# EAGLE design BT_Audio_iJoey (EAGLE 6.1)
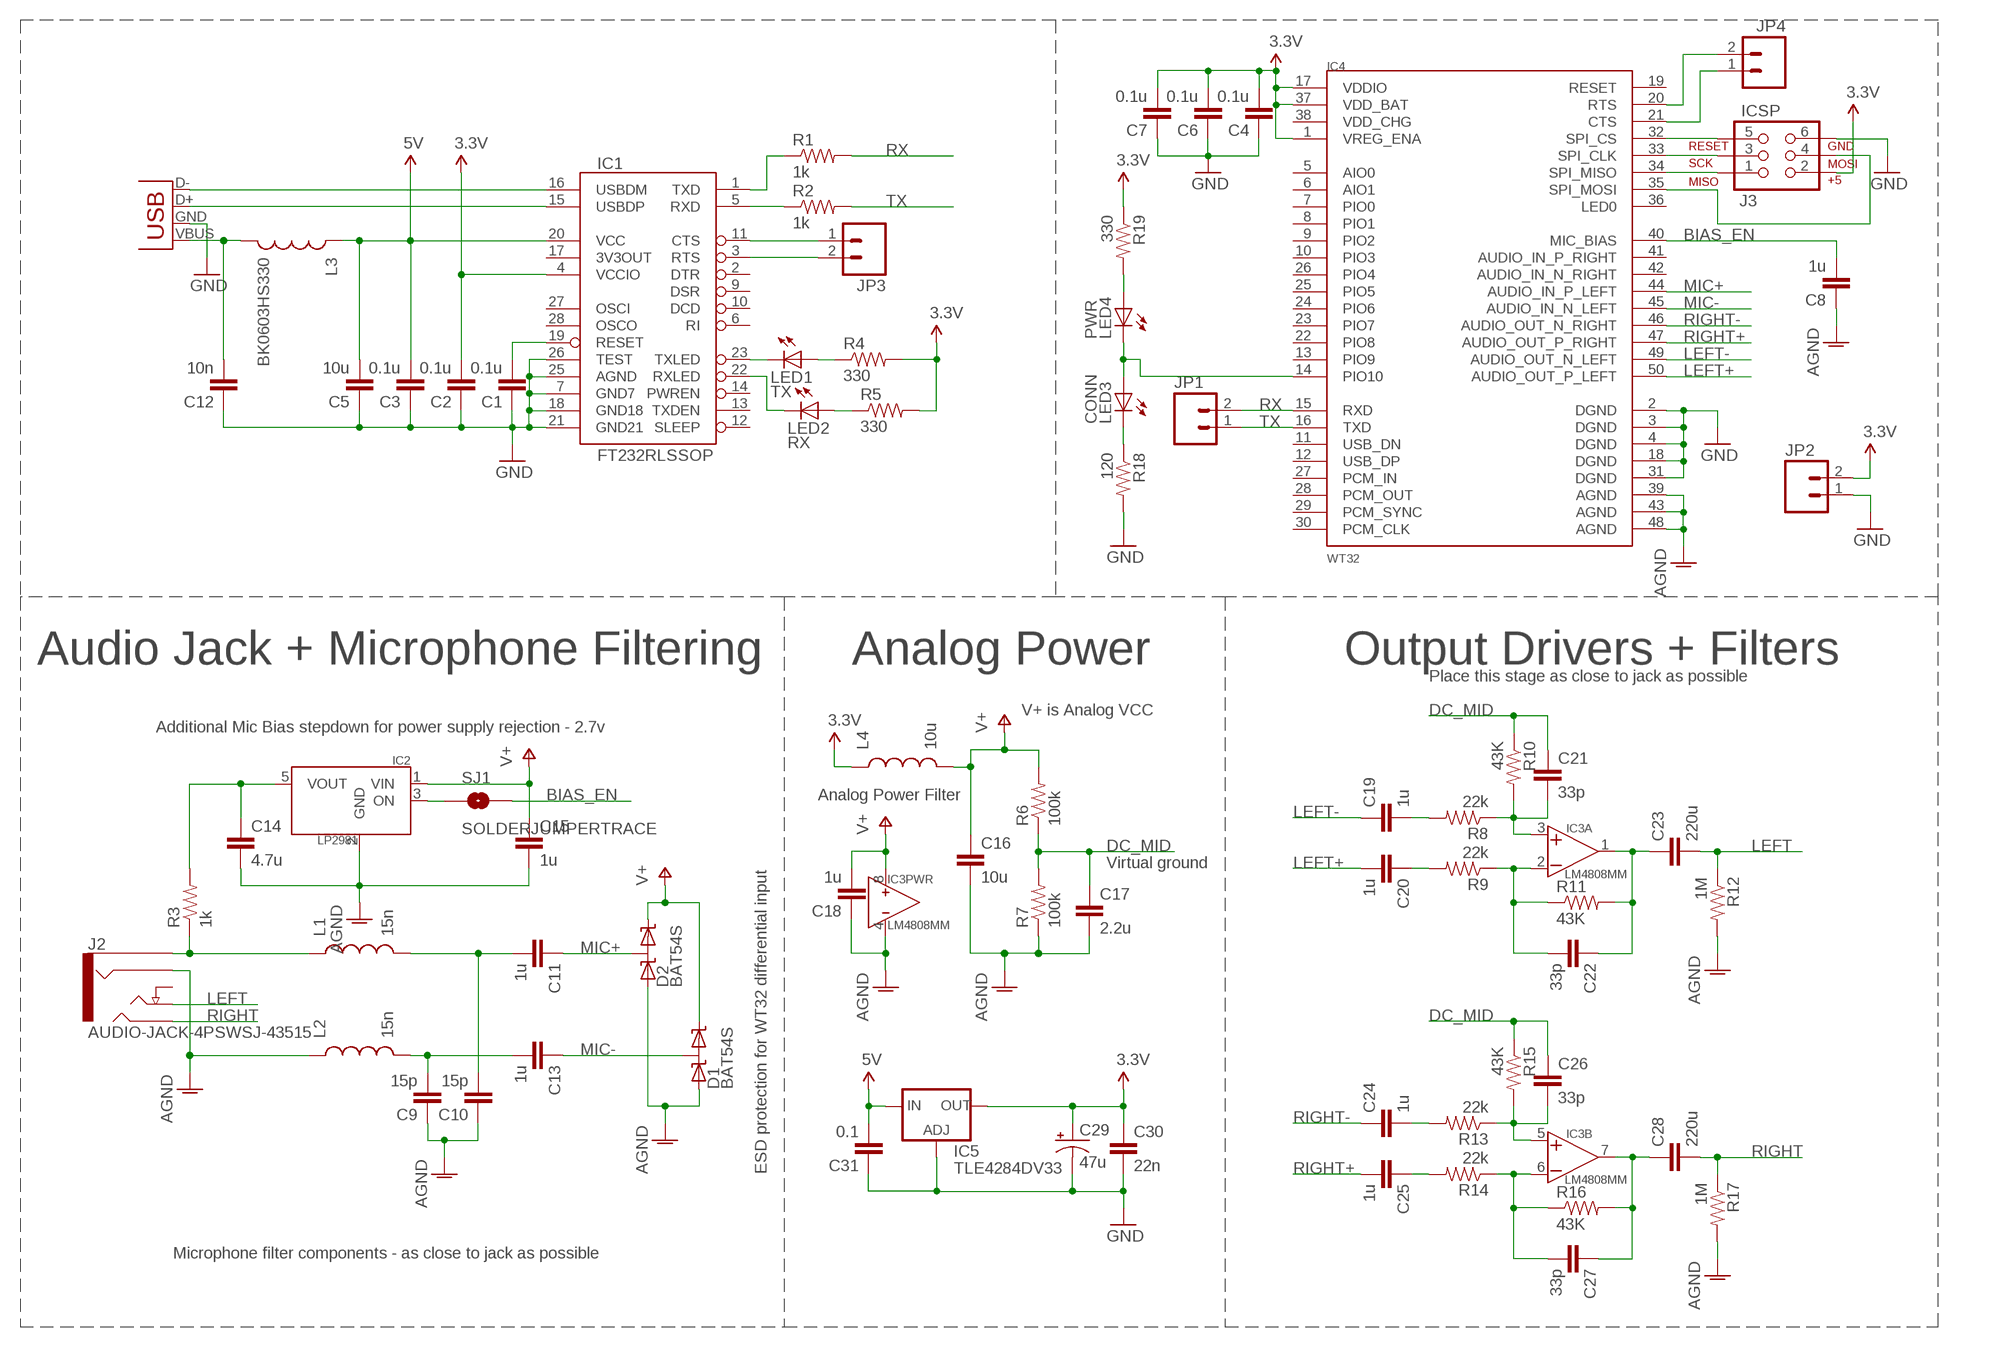
[diagram p0: schematic, sheet 1]

## Parts
C1  0.1u  CAP0603-CAP  [0603-CAP]
C2  0.1u  CAP0603-CAP  [0603-CAP]
C3  0.1u  CAP0603-CAP  [0603-CAP]
C4  0.1u  CAP0603-CAP  [0603-CAP]
C5  10u  CAP0805  [0805]
C6  0.1u  CAP0603-CAP  [0603-CAP]
C7  0.1u  CAP0603-CAP  [0603-CAP]
C8  1u  CAP0603-CAP  [0603-CAP]
C9  15p  CAP0603-CAP  [0603-CAP]
C10  15p  CAP0603-CAP  [0603-CAP]
C11  1u  CAP0603-CAP  [0603-CAP]
C12  10n  CAP0603-CAP  [0603-CAP]
C13  1u  CAP0603-CAP  [0603-CAP]
C14  4.7u  CAP0603-CAP  [0603-CAP]
C15  1u  CAP0603-CAP  [0603-CAP]
C16  10u  CAP0603-CAP  [0603-CAP]
C17  2.2u  CAP0603-CAP  [0603-CAP]
C18  1u  CAP0603-CAP  [0603-CAP]
C19  1u  CAP0603-CAP  [0603-CAP]
C20  1u  CAP0603-CAP  [0603-CAP]
C21  33p  CAP0603-CAP  [0603-CAP]
C22  33p  CAP0603-CAP  [0603-CAP]
C23  220u  CAP1210  [1210]
C24  1u  CAP0603-CAP  [0603-CAP]
C25  1u  CAP0603-CAP  [0603-CAP]
C26  33p  CAP0603-CAP  [0603-CAP]
C27  33p  CAP0603-CAP  [0603-CAP]
C28  220u  CAP1210  [1210]
C29  47u  CAP_POLD  [PANASONIC_D]
C30  22n  CAP0603-CAP  [0603-CAP]
C31  0.1  CAP0603-CAP  [0603-CAP]
D1  BAT54S  DIODE_DUAL_CLAMP  [SOT23]
D2  BAT54S  DIODE_DUAL_CLAMP  [SOT23]
IC1  FT232RLSSOP  [SSOP28DB]
IC2  LP2981  [SOT23-5]
IC3  LM4808MM  [SO8]
IC4  WT32  [WT32]
IC5  TLE4284DV33  V_REG_317DPACK  [V-REG_DPACK]
J1  USB-A-H  [USB-A-H]
J2  AUDIO-JACK-4PSWSJ-43515  [SJ-4351X]
J3  ICSP  AVR_SPI_PRG_6PTH  [2X3]
JP1  M02PTH  [1X02]
JP2  M02PTH  [1X02]
JP3  M02PTH  [1X02]
JP4  M02PTH  [1X02]
L1  15n  INDUCTOR0603  [0603]
L2  15n  INDUCTOR0603  [0603]
L3  BK0603HS330  INDUCTOR0603  [0603]
L4  10u  INDUCTOR0603  [0603]
LED1  TX  LED0603  [LED-0603]
LED2  RX  LED0603  [LED-0603]
LED3  CONN  LED0603  [LED-0603]
LED4  PWR  LED0603  [LED-0603]
R1  1k  RESISTOR0603-RES  [0603-RES]
R2  1k  RESISTOR0603-RES  [0603-RES]
R3  1k  RESISTOR0603-RES  [0603-RES]
R4  330  RESISTOR0603-RES  [0603-RES]
R5  330  RESISTOR0603-RES  [0603-RES]
R6  100k  RESISTOR0603-RES  [0603-RES]
R7  100k  RESISTOR0603-RES  [0603-RES]
R8  22k  RESISTOR0603-RES  [0603-RES]
R9  22k  RESISTOR0603-RES  [0603-RES]
R10  43K  RESISTOR0603-RES  [0603-RES]
R11  43K  RESISTOR0603-RES  [0603-RES]
R12  1M  RESISTOR0603-RES  [0603-RES]
R13  22k  RESISTOR0603-RES  [0603-RES]
R14  22k  RESISTOR0603-RES  [0603-RES]
R15  43K  RESISTOR0603-RES  [0603-RES]
R16  43K  RESISTOR0603-RES  [0603-RES]
R17  1M  RESISTOR0603-RES  [0603-RES]
R18  120  RESISTOR0603-RES  [0603-RES]
R19  330  RESISTOR0603-RES  [0603-RES]
SJ1  SOLDERJUMPERTRACE  [SJ_2S-TRACE]

## Nets
3.3V: C2.2 C4.2 C6.2 C7.2 C29.+ C30.1 IC1.4(VCCIO) IC4.1(VREG_ENA) IC4.17(VDDIO) IC4.37(VDD_BAT) IC5.4(OUT) J3.2 JP2.2 L4.1 R4.2 R5.2 R19.1
5V: C3.2 C5.2 C31.2 IC1.20(VCC) IC5.3(IN) L3.1
AGND: C8.1 C9.1 C10.1 C14.2 C15.2 C16.2 C17.2 C18.1 D1.1(AN) D2.1(AN) IC2.2(GND) IC3.4(PWR:-V) IC4.39(AGND) IC4.43(AGND) IC4.48(AGND) J2.4(RING2) L2.1 R7.1 R12.2 R17.2
BIAS: C14.1 IC2.5(VOUT) R3.2
BIAS_EN: C8.2 IC4.40(MIC_BIAS) SJ1.2
DC_MID: C17.1 C21.1 C26.1 R6.1 R7.2 R10.1 R15.1
GND: C1.1 C2.1 C3.1 C4.1 C5.1 C6.1 C7.1 C12.1 C29.- C30.2 C31.1 IC1.7(GND7) IC1.18(GND18) IC1.21(GND21) IC1.25(AGND) IC1.26(TEST) IC4.2(DGND) IC4.3(DGND) IC4.4(DGND) IC4.18(DGND) IC4.31(DGND) IC5.1(ADJ) J1.GND(VBUS) J3.6 JP2.1 R18.2
LEFT: C23.2 J2.2(TIP) R12.1
LEFT+: C20.2 IC4.50(AUDIO_OUT_P_LEFT)
LEFT-: C19.1 IC4.49(AUDIO_OUT_N_LEFT)
MIC+: C11.1 D2.3(COM) IC4.44(AUDIO_IN_P_LEFT)
MIC-: C13.1 D1.3(COM) IC4.45(AUDIO_IN_N_LEFT)
N$1: IC1.15(USBDP) J1.D+(D-)
N$2: IC1.16(USBDM) J1.D-(D+)
N$3: IC4.33(SPI_CLK) J3.3
N$4: C1.2 IC1.19(RESET)
N$5: C12.2 J1.VBUS(GND) L3.2
N$6: IC4.32(SPI_CS) J3.5
N$7: IC1.5(RXD) R2.1
N$8: IC1.1(TXD) R1.1
N$9: IC4.34(SPI_MISO) J3.1
N$10: IC1.23(TXLED) LED1.C
N$11: IC1.22(RXLED) LED2.C
N$12: LED2.A R5.1
N$13: LED1.A R4.1
N$14: IC4.35(SPI_MOSI) J3.4
N$15: C9.2 C13.2 L2.2
N$16: J2.1(SLEEVE) L1.1 R3.1
N$17: C10.2 C11.2 L1.2
N$18: C22.2 IC3.2(A:-) R9.1 R11.1
N$19: C20.1 R9.2
N$20: C21.2 IC3.3(A:+) R8.1 R10.2
N$21: C19.2 R8.2
N$22: C22.1 C23.1 IC3.1(A:O) R11.2
N$23: C27.2 IC3.6(B:-) R14.1 R16.1
N$24: C25.1 R14.2
N$25: C26.2 IC3.5(B:+) R13.1 R15.2
N$26: C24.2 R13.2
N$27: C27.1 C28.1 IC3.7(B:O) R16.2
N$28: IC2.3(ON) SJ1.1
N$29: IC1.11(CTS) JP3.1
N$30: IC1.3(RTS) JP3.2
N$31: IC4.21(CTS) JP4.1
N$32: IC4.20(RTS) JP4.2
N$33: IC4.14(PIO10) LED3.A LED4.C
N$34: LED3.C R18.1
N$35: LED4.A R19.2
RIGHT: C28.2 J2.3(RING1) R17.1
RIGHT+: C25.2 IC4.47(AUDIO_OUT_P_RIGHT)
RIGHT-: C24.1 IC4.46(AUDIO_OUT_N_RIGHT)
RX: IC4.15(RXD) JP1.2 R1.2
TX: IC4.16(TXD) JP1.1 R2.2
V+: C15.1 C16.1 C18.2 D1.2(CAT) D2.2(CAT) IC2.1(VIN) IC3.8(PWR:+V) L4.2 R6.2
Unconnected: IC1.2(DTR) IC1.6(RI) IC1.9(DSR) IC1.10(DCD) IC1.12(SLEEP) IC1.13(TXDEN) IC1.14(PWREN) IC1.17(3V3OUT) IC1.27(OSCI) IC1.28(OSCO) IC4.5(AIO0) IC4.6(AIO1) IC4.7(PIO0) IC4.8(PIO1) IC4.9(PIO2) IC4.10(PIO3) IC4.11(USB_DN) IC4.12(USB_DP) IC4.13(PIO9) IC4.19(RESET) IC4.22(PIO8) IC4.23(PIO7) IC4.24(PIO6) IC4.25(PIO5) IC4.26(PIO4) IC4.27(PCM_IN) IC4.28(PCM_OUT) IC4.29(PCM_SYNC) IC4.30(PCM_CLK) IC4.36(LED0) IC4.38(VDD_CHG) IC4.41(AUDIO_IN_P_RIGHT) IC4.42(AUDIO_IN_N_RIGHT) J2.5(SWITCH)

## Notes on the sheet
- Audio Jack + Microphone Filtering | Analog Power | Output Drivers + Filters
- Place this stage as close to jack as possible
- V+ is Analog VCC
- Additional Mic Bias stepdown for power supply rejection - 2.7v
- Analog Power Filter
- Virtual ground
- ESD protection for WT32 differential input
- Microphone filter components - as close to jack as possible

## Library data of the parts
C1-C28 C30 C31 = BUG:CAP: Capacitor Standard 0603 ceramic capacitor, and 0.1" leaded capacitor.
C29 = BUG:CAP_POL: Capacitor Polarized These are standard SMD and PTH capacitors. Normally 10uF, 47uF, and 100uF in electrolytic and tantalum varieties. Always verify the external diameter of the through hole cap, it varies with capacity, voltage, and manufacturer. The EIA devices should be standard.
D1 D2 = BUG:DIODE_DUAL_CLAMP
IC1 = SparkFun-DigitalIC:FT232RL: USB UART FT232RL 4th Generation USB UART (USB <-> Serial) Controller. Spark Fun Electronics SKU : COM-00650
IC2 = BUG:LP2981: 100mA Low Dropout Regulator LDO with Shutdown 7mv - 200mv Dropout voltage
IC3 = BUG:LM4808: LM4808 opamp dual 105mW headphone amplifier 16 ohm minimum load single-sided supply
IC4 = BUG:WT32: Blue Giga Audio Bluetooth Module Footprint is not confirmed yet.
IC5 = BUG:V_REG_317: Voltage Regulator Standard LM317 adjustable voltage regulator. AOI (Adjust Output Input). Google 'LM317 Calculator' for easy to use app to get the two resistor values needed. 240/720 for 5V output. 240/390 for 3.3V output. Spark Fun Electronics SKU : COM-00527
J1 = SparkFun-Connectors:USB: USB Connectors USB-B-PTH is fully proven SKU : PRT-00139 USB-miniB is fully proven SKU : PRT-00587 USB-A-PCB is untested. USB-A-H is throughly reviewed, but untested. Spark Fun Electronics SKU : PRT-00437 USB-B-SMT is throughly reviewed, but untested. Needs silkscreen touching up. USB-A-S has not been used/tested USB-MB-H has not been used/tested
J2 = BUG:AUDIO-JACK-4PSW
J3 = SparkFun-Connectors:AVR_SPI_PRG_6: AVR ISP 6 Pin This is the reduced ISP connector for AVR programming. Common on Arduino. This footprint will take up less PCB space and can be used with a 10-pin to 6-pin adapter such as SKU: BOB-08508
JP1-JP4 = SparkFun-Connectors:M02: Header 2 Standard 2-pin 0.1" header. Use with straight break away headers (SKU : PRT-00116), right angle break away headers (PRT-00553), swiss pins (PRT-00743), machine pins (PRT-00117), and female headers (PRT-00115). Molex polarized connector foot print use with SKU : PRT-08233 with associated crimp pins and housings.
L1-L4 = BUG:INDUCTOR: Inductors Basic Inductor/Choke - 0603 and 1206. Footprints are not proven and vary greatly between part numbers.
LED1-LED4 = BUG:LED: LEDs Standard schematic elements and footprints for 5mm, 3mm, 1206, and 0603 sized LEDs. 5mm - Spark Fun Electronics SKU : COM-00529 (and others)
R1-R19 = BUG:RESISTOR: Resistor Basic schematic elements and footprints for 0603, 1206, and PTH resistors.
SJ1 = SparkFun-Passives:SOLDERJUMPER: Solder Jumper Standard SMD solder jumper. Used to automate production. Two varients : Normally Open and Normally Closed are the same, but have different paste layers. NC will have a large amount of paste and should jumper during reflow.

## Board
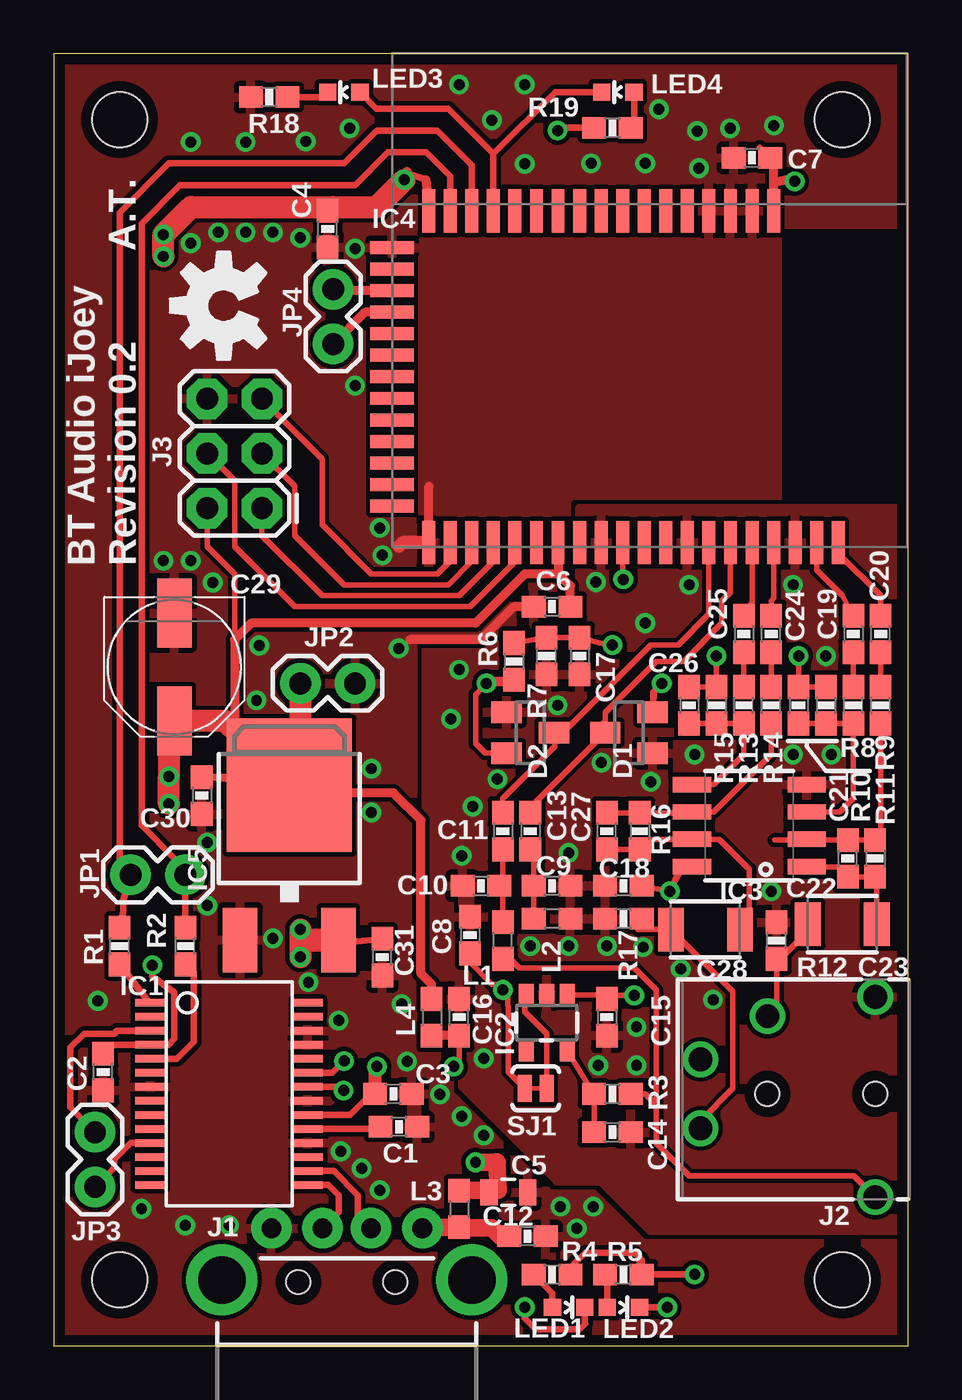
[diagram p1: board, top side]
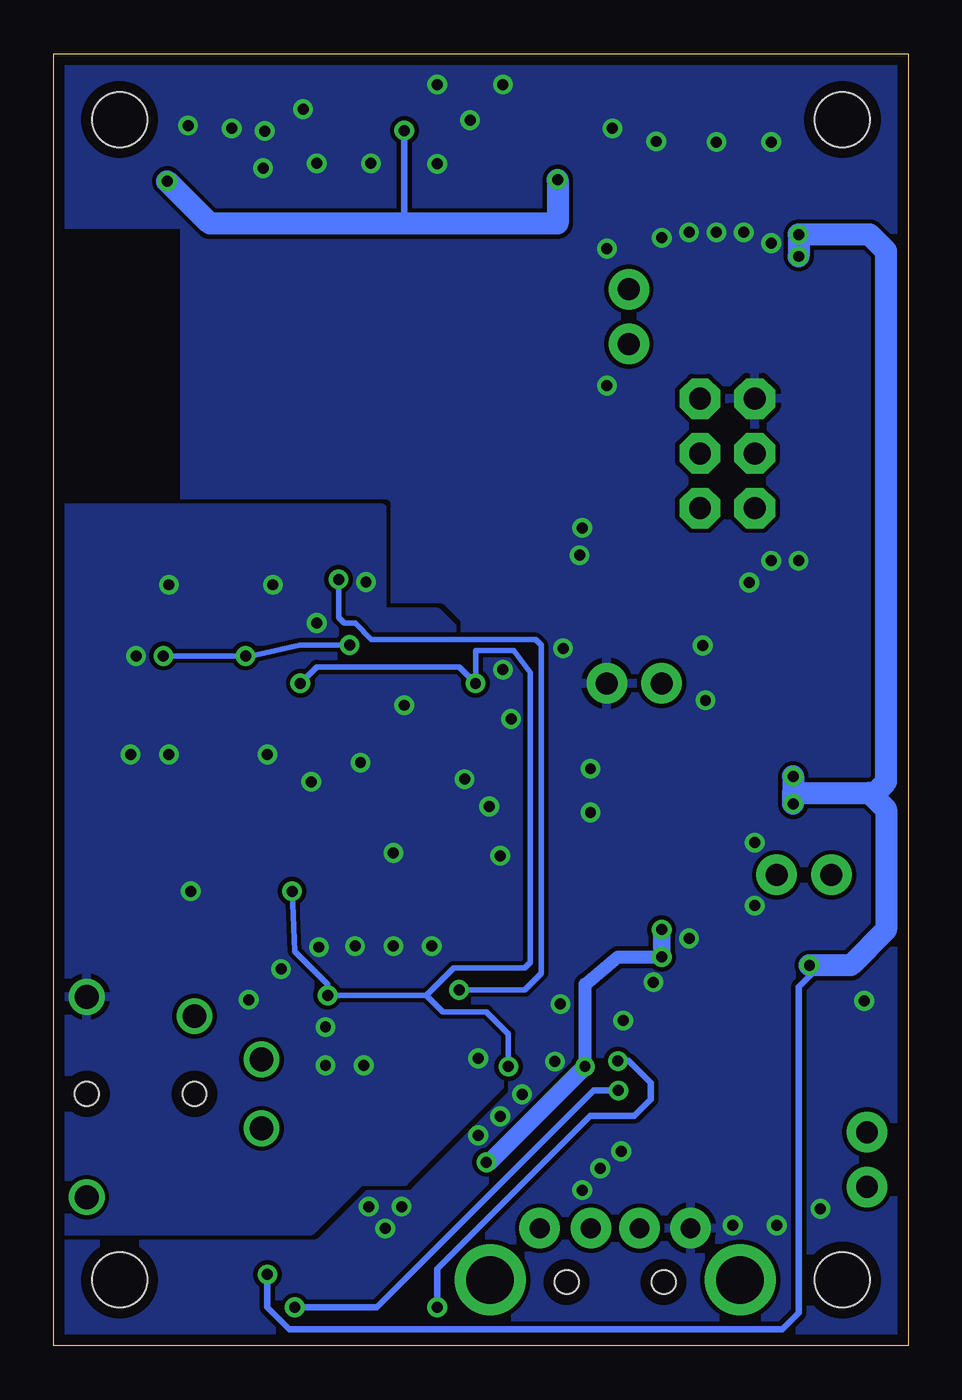
[diagram p2: board, bottom side, seen from below]

Size 39.62 x 59.94 mm. Coordinates in mm from the lower left corner, seen from the top.
Outline: 39.62,59.94 0,59.94 0,0 39.62,0 39.62,59.94
Copper layers (1*16): Top 0.0178mm / dielectric 59mil / Bottom 0.0178mm
Design rules: minimum track width 8mil, minimum drill 14mil, track to track 8mil, track to pad 8mil, pad to pad 8mil, via to via 8mil, smd to smd 8mil, copper to edge 20mil, drill to drill 16mil, minimum pad ring 8mil, minimum via ring 8mil, stop-mask expansion 3mil, vias tented up to drill 0mil, thermal gap 10mil
Holes 2.54 mm at 3.05,3.05 36.58,3.05 36.58,56.9 3.05,56.9

### Footprints (pad centres in the part's own frame; a part is rotated, then mirrored left to right if it is on the bottom)
0603-CAP = smd 1.1 x 1: 1 -0.85,0; 2 0.85,0
0805 = smd 0.8 x 1.2: 1 -0.9,0; 2 0.9,0
1210 = smd 1.2 x 2: 1 -1.6,0; 2 1.6,0
PANASONIC_D = smd 3.2 x 1.6: + 2.5,0; - -2.5,0
SOT23 = smd 1 x 1.4: 1 -0.95,-1.1; 2 0.95,-1.1; 3 0,1.1
SSOP28DB = smd 0.348 x 1.397: 1 -4.225,-3.656; 2 -3.575,-3.656; 3 -2.925,-3.656; 4 -2.275,-3.656; 5 -1.625,-3.656; 6 -0.975,-3.656; 7 -0.325,-3.656; 8 0.325,-3.656; 9 0.975,-3.656; 10 1.625,-3.656; 11 2.275,-3.656; 12 2.925,-3.656; 13 3.575,-3.656; 14 4.225,-3.656; 15 4.225,3.656; 16 3.575,3.656; 17 2.925,3.656; 18 2.275,3.656; 19 1.625,3.656; 20 0.975,3.656; 21 0.325,3.656; 22 -0.325,3.656; 23 -0.975,3.656; 24 -1.625,3.656; 25 -2.275,3.656; 26 -2.925,3.656; 27 -3.575,3.656; 28 -4.225,3.656
SOT23-5 = smd 0.7 x 1: 1 -0.95,-1.3; 2 0,-1.3; 3 0.95,-1.3; 4 0.95,1.3; 5 -0.95,1.3
SO8 = smd 0.711 x 1.778: 1 -1.905,-2.662; 2 -0.635,-2.662; 3 0.635,-2.662; 4 1.905,-2.662; 5 1.905,2.662; 6 0.635,2.662; 7 -0.635,2.662; 8 -1.905,2.662
WT32 = smd 2 x 0.6: 1 -7.7,5.7; 2 -7.7,4.7; 3 -7.7,3.7; 4 -7.7,2.7; 5 -7.7,1.7; 6 -7.7,0.7; 7 -7.7,-0.3; 8 -7.7,-1.3; 9 -7.7,-2.3; 10 -7.7,-3.3; 11 -7.7,-4.3; 12 -7.7,-5.3; 13 -7.7,-6.3; 14 -7.7,-7.3; 15 -7.7,-8.3; 16 -7.7,-9.3; 17 -7.7,-10.3; 31 7.7,-10.3; 32 7.7,-9.3; 33 7.7,-8.3; 34 7.7,-7.3; 35 7.7,-6.3; 36 7.7,-5.3; 37 7.7,-4.3; 38 7.7,-3.3; 39 7.7,-2.3; 40 7.7,-1.3; 41 7.7,-0.3; 42 7.7,0.7; 43 7.7,1.7; 44 7.7,2.7; 45 7.7,3.7; 46 7.7,4.7; 47 7.7,5.7; 48 7.7,6.7; 49 7.7,7.7; 50 7.7,8.7 | smd 0.6 x 2: 18 -6,-12; 19 -5,-12; 20 -4,-12; 21 -3,-12; 22 -2,-12; 23 -1,-12; 24 0,-12; 25 1,-12; 26 2,-12; 27 3,-12; 28 4,-12; 29 5,-12; 30 6,-12
V-REG_DPACK = smd 1.6 x 3: 1 -2.28,-4.8; 3 2.28,-4.8 | smd 5.8 x 6.2: 4 0,2.38
USB-A-H = drill 0.914 pad 1.88: D+ 2.4,1.127; D- 2.4,-1.127; GND 2.4,3.5; VBUS 2.4,-3.5 | drill 2.2: GND2 0,-5.8; GND3 0,5.8 | hole 1.1: -0.1,2.25; -0.1,-2.25
SJ-4351X = drill 1.1: 1 0,4.8; 2 5,-3.6; 3 8.1,1.6; 4 0,-4.5; 5 8.1,-1.6 | hole 1.1: 0,0; 5,0
2X3 = drill 1.016 pad 1.88 octagon: 1 0,0; 2 0,2.54; 3 2.54,0; 4 2.54,2.54; 5 5.08,0; 6 5.08,2.54
1X02 = drill 1.016 pad 1.88: 1 0,0; 2 2.54,0
0603 = smd 1.1 x 1: 1 -0.85,0; 2 0.85,0
LED-0603 = smd 0.8 x 0.8: A 0,-0.75; C 0,0.75
0603-RES = smd 1.1 x 1: 1 -0.85,0; 2 0.85,0
SJ_2S-TRACE = smd 0.635 x 1.27: 1 -0.508,0; 2 0.508,0

### Placement (x,y rotation side)
C1  16,10.16 180 top
C2  2.29,12.7 90 top
C3  15.75,11.68 180 top
C4  12.7,51.82 90 top
C5  21.08,7.11 180 top
C6  23.11,34.29 0 top
C7  32.38,55.12 0 top
C8  19.3,19.05 270 top
C9  23.11,21.34 180 top
C10  19.81,21.34 0 top
C11  20.83,23.88 270 top
C12  21.97,5.08 180 top
C13  22.1,23.88 270 top
C14  25.91,9.91 0 top
C15  25.65,15.24 270 top
C16  18.8,15.24 90 top
C17  24.38,32 270 top
C18  26.42,21.34 0 top
C19  37.08,33.02 270 top
C20  38.35,33.02 90 top
C21  34.54,29.72 270 top
C22  36.83,22.61 90 top
C23  36.58,19.56 180 top
C24  32,33.02 270 top
C25  33.27,33.02 90 top
C26  29.46,29.72 270 top
C27  25.65,23.88 90 top
C28  30.23,19.3 180 top
C29  5.59,31.5 270 top
C30  6.86,25.53 270 top
C31  15.24,18.03 90 top
D1  26.67,28.45 90 top
D2  22.1,28.45 270 top
DRILEGEND  [DRILEGEND]  90.68,11.3 0 top  (outside the outline)
IC1  8.13,11.68 270 top
IC2  22.86,14.99 180 top
IC3  32.26,24.13 90 top
IC4  27.69,44.96 270 top
IC5  10.92,23.62 0 top
J1  13.59,3.05 90 top
J2  38.1,11.68 180 top
J3  9.65,38.86 90 top
JP1  6.1,21.84 180 top
JP2  13.97,30.73 180 top
JP3  1.91,7.37 90 top
JP4  12.95,46.48 90 top
L1  20.83,18.8 90 top
L2  23.11,19.81 180 top
L3  18.8,6.35 270 top
L4  17.53,15.24 270 top
LED1  23.88,1.78 270 top
LED2  26.42,1.78 270 top
LED3  13.45,58.16 90 top
LED4  26.16,58.17 90 top
R1  3.05,18.54 90 top
R2  6.1,18.54 90 top
R3  25.91,11.68 180 top
R4  23.11,3.3 0 top
R5  26.42,3.3 0 top
R6  21.34,31.75 270 top
R7  22.86,32 90 top
R8  37.08,29.72 90 top
R9  38.35,29.72 90 top
R10  35.81,29.72 270 top
R11  38.1,22.61 270 top
R12  33.53,18.8 90 top
R13  32,29.72 90 top
R14  33.27,29.72 90 top
R15  30.73,29.72 270 top
R16  27.18,23.88 270 top
R17  26.42,19.81 180 top
R18  9.99,57.94 180 top
R19  25.91,56.52 0 top
SJ1  22.35,11.94 180 top
U$1  [A5L-LOC]  -17.27,-41.78 0 top  (outside the outline)
U$2  [OSHW-LOGO-M]  7.87,48.26 90 top

### Tracks (layer width: path | path; a pad name or v marks a point on that pad's centre or on a via)
3.3V  (via drill 0.51)
  Top 0.254: J3.2 7.11,37.08 8.38,35.81 8.38,32.77 | 8.38,29.45 7.93,29 | C30.1 12.81,25.8 12.95,25.65
  Top 0.305: C30.1 11.06,26.43 10.92,25.91 IC5.4 10.92,26.16 | v4.57,17.65 4.57,17.14 5.59,16.38 5.59,14.22 5.32,13.96 IC1.4 2.78,13.96 2.29,13.46 C2.2 | 33.26,55.22 C7.2 32.75,55.6 | 17.27,54.1 16.51,54.36 v16.26,54.1 | R5.2 27.27,3.98 27.18,4.06 | R4.2 23.88,3.3 24.13,3.56 24.13,3.81 24.64,4.32 26.92,4.32 27.18,4.06 | C4.2 12.79,52.67 12.95,52.83 | R19.1 23.5,56.52 v23.37,56.39 | 27.18,4.06 27.18,3.3 v29.72,3.3
  Top 0.406: IC4.37 23.39,35.83 | IC4.17 17.39,52.97 17.27,54.1 | 16.37,54.5 v16.26,54.1 | IC4.1 33.39,54.72 33.53,54.86 33.53,55.12 C7.2 33.4,55.16 33.4,53.98 34.04,54.1 v34.37,54.03 | L4.1 17.53,16.76 17.02,17.27 17.02,24.38 15.75,25.65 12.95,25.65 11.94,25.65 11.18,26.42 11.18,26.26 IC5.4 | 23.39,35.83 23.37,35.81 21.84,35.81 19.56,33.53 9.14,33.53 8.38,32.77 8.38,28.96 8.18,28.75 | C6.2 23.96,35.25 23.39,35.83
  Top 1.016: IC5.4 8.18,28.75 7.93,29 5.88,29 5.59,28.7 5.33,28.7 | 5.33,28.7 v5.33,26.42 v5.33,25.15 | 5.33,28.7 5.59,28.96 C29.+ | JP2.2 11.43,26.67 10.92,26.16 | v16.26,54.1 14.99,52.83 12.95,52.83 6.35,52.83 v5.08,51.56 v5.08,50.55
  Bottom 0.305: v23.37,56.39 23.37,52.07 | v29.72,3.3 29.72,1.78 28.7,0.76 5.84,0.76 5.08,1.52 5.08,16.64 4.06,17.65
  Bottom 1.016: 5.33,25.65 v5.33,25.15 5.33,25.4 5.08,25.65 | v5.33,26.42 5.33,25.65 | 5.33,25.65 5.08,25.65 | 1.78,25.65 1.52,25.65 1.02,26.16 1.02,50.8 1.78,51.56 v5.08,51.56 v5.08,50.55 | 5.08,25.65 1.78,25.65 | 1.78,25.65 1.02,24.89 1.02,19.3 2.67,17.65 4.06,17.65 v4.57,17.65 | v34.37,54.03 32.38,52.07 23.37,52.07 16.26,52.07 v16.26,54.1
5V  (via drill 0.51)
  Top 0.305: 14.99,11.68 C3.2 14.73,11.68 13.76,10.71 IC1.20 | C31.2 13.34,18.68 IC5.3
  Top 0.61: C3.2 14.9,12.87 v14.99,12.95
  Top 0.813: L3.1 20.6,7.2 | 20.6,7.2 C5.2 | 20.6,7.2 20.55,8.54 20.57,8.51 v19.56,8.51
  Top 1.016: IC5.3 11.46,18.82 11.43,18.8 | 11.43,18.8 v11.43,18.03 | v11.43,19.3 11.43,18.8 | 11.43,18.8 13.21,18.8
  Bottom 0.61: v14.99,12.95 14.99,16.76 13.46,18.03 v11.43,18.03
  Bottom 0.813: v11.43,18.03 v11.43,19.3 | v19.56,8.51 19.43,8.51 v14.99,12.95
AGND  (via drill 0.51)
  other vias: 34.29,27.43 36.07,27.43 35.81,32 34.29,35.31 33.27,21.08 22.1,18.54 23.88,18.54 27.33,18.49 29.08,17.48 30.58,16.05 27.03,14.78 27.03,13 25.25,13 23.37,29.72 23.88,22.86 27.69,26.16 29.46,35.31 29.72,27.43 25.15,35.43 18.41,29.08 18.8,31.37 20.57,26.29 25.4,27.05 19.43,25.02 18.92,22.73 25.65,18.54 27.43,33.53 19.94,13.34
  pour Top (rank 4): 39.12,5.33 27.69,5.33 25.4,7.62 23.37,7.62 17.27,13.72 17.27,32.26 20.07,32.26 21.84,34.04 24.38,34.04 24.38,38.86 39.12,38.86
  pour Bottom (rank 4): 39.12,5.33 27.69,5.33 25.4,7.62 23.37,7.62 17.27,13.72 17.27,32.26 20.07,32.26 21.84,34.04 24.38,34.04 24.38,38.86 39.12,38.86
BIAS
  Top 0.254: IC2.5 25.06,11.63 R3.2 C14.1
BIAS_EN  (via drill 0.51)
  Top 0.254: IC4.40 26.39,35.34 v26.42,35.56 | C8.2 19.3,17.78 20.32,16.76 20.57,16.76 v20.83,16.51 21.05,16.29 21.05,15.78 21.08,15.75 21.08,12.7 SJ1.2
  Bottom 0.254: v20.83,16.51 17.78,16.51 17.02,17.27 17.02,32.51 17.27,32.77 24.89,32.77 25.65,33.53 26.16,33.53 26.42,33.78 v26.42,35.56
DC_MID  (via drill 0.51)
  Top 0.254: R10.1 C21.1 v34.54,32 | C26.1 R15.1 v30.73,32 | R6.1 R7.2 C17.1 25.31,32.6 v25.91,32.51
  Bottom 0.254: v34.54,32 v30.73,32 30.48,32 28.19,32.51 v25.91,32.51
GND  (via drill 0.51)
  Top 0.406: C6.1 21.34,34.29 19.81,32.77 16.51,32.77 | 17.4,38.1 17.4,39.88
  Top 0.61: IC4.31 16.18,37.26 16,37.08
  other vias: 4.06,6.35 13.31,9.02 14.27,8.23 13.21,15.09 11.81,16.87 5.08,36.42 6.35,36.42 7.37,35.41 14.73,24.74 14.73,26.77 7.11,23.34 10.16,18.9 7.11,20.42 16.13,15.85 13.97,50.9 11.43,51.41 27.43,54.86 16,32.36 15.24,36.68 15.11,37.95 9.4,29.95 9.53,32.49 13.97,44.55 29.92,54.64 28.07,57.38 20.32,56.87 21.84,54.84 8.89,55.85 6.35,55.85 13.72,56.49 6.35,51.16 7.62,51.66 8.89,51.66 10.16,51.66 11.68,55.88 31.37,56.49 21.84,58.52 15.11,7.21 33.4,56.62 19.94,9.75 18.92,10.64 17.91,11.66 16.38,13.18 24.92,54.86 8.13,5.59 6.1,5.59 2.03,16 23.5,6.45 25.02,6.45 24.26,5.44 18.8,58.52 29.84,56.36
  pour Bottom (rank 5): 0.51,0.51 39.12,0.51 39.12,59.44 0.51,59.44
  pour Top (rank 5): 0.51,0.51 39.12,0.51 39.12,59.44 0.51,59.44
LEFT
  Top 0.254: C23.2 34.98,19.23 33.78,18.03 33.62,18.03 R12.1 33.53,15.71 J2.2
LEFT+
  Top 0.254: IC4.50 36.39,36.77 38.35,34.8 C20.2
LEFT-
  Top 0.254: IC4.49 35.39,35.99 36.58,34.8 C19.1
MIC+
  Top 0.254: IC4.44 30.39,33.94 28.96,32.51 27.69,32.51 23.88,28.7 23.45,28.7 D2.3 | D2.3 23.37,28.45 | C11.1 20.83,25.4 23.24,27.81 23.24,28.41 D2.3
MIC-
  Top 0.254: IC4.45 31.39,34.94 30.99,34.54 30.99,33.53 29.21,31.75 27.94,31.75 25.57,29.38 25.57,28.96 | 25.57,28.96 D1.3 22.35,25.23 22.35,25.15 C13.1 | 25.15,28.53 25.57,28.96
N$1
  Top 0.305: IC1.15 12.73,7.46 13.21,6.99 13.21,6.19 J1.D+
N$2
  Top 0.305: IC1.16 12.97,8.11 14.1,6.99 14.1,6.07 J1.D-
N$3
  Top 0.254: IC4.33 19.39,36.4 18.29,35.31 13.46,35.31 11.18,37.59 11.18,39.88 J3.3
N$4
  Top 0.305: IC1.19 14.8,10.06 C1.2
N$5
  Top 0.813: J1.VBUS 17.09,5.5 L3.2 18.84,5.46 20.32,5.46 20.7,5.08 C12.2
N$6
  Top 0.254: IC4.32 18.39,36.42 17.78,35.81 14.73,35.81 12.45,38.1 12.45,41.15 J3.5
N$7
  Top 0.305: IC1.5 5.69,13.31 6.48,14.1 6.48,17.31 R2.1
N$8
  Top 0.305: R1.1 4.32,16.06 IC1.1
N$9
  Top 0.254: IC4.34 20.39,36.39 18.8,34.8 12.45,34.8 9.65,37.59 J3.1
N$10  (via drill 0.51)
  Top 0.305: IC1.23 12.91,12.66 v13.46,13.21 | v21.84,1.78 21.84,1.27 22.35,0.76 24.38,0.76 24.64,1.02 24.63,1.03 LED1.C
  Bottom 0.305: v13.46,13.21 12.95,13.21 11.94,12.19 11.94,11.43 12.7,10.67 14.73,10.67 21.84,3.56 v21.84,1.78
N$11  (via drill 0.51)
  Top 0.305: IC1.22 13.28,12.01 v13.44,11.84 | v28.45,1.78 LED2.C
  Bottom 0.305: v13.44,11.84 14.58,11.84 24.64,1.78 v28.45,1.78
N$12
  Top 0.305: 25.41,3.15 R5.1 25.67,3.2 LED2.A
N$13
  Top 0.305: 22.36,3.2 R4.1 23.13,2.44 LED1.A
N$14
  Top 0.254: IC4.35 21.39,36.37 19.3,34.29 11.18,34.29 8.38,37.08 8.38,40.13 J3.4
N$15
  Top 0.254: C13.2 22.35,23.11 22.26,22.95 C9.2 L2.2
N$16
  Top 0.254: 27.94,11.18 27.94,16.51 26.92,17.53 21.59,17.53 21.17,17.95 L1.1 | 27.94,11.18 27.94,9.4 29.46,7.87 37.11,7.87 J2.1 | R3.1 27.43,11.68 27.94,11.18
N$17
  Top 0.254: C11.2 20.83,21.5 C10.2 20.83,21.17 L1.2
N$18
  Top 0.254: IC3.2 33.44,23.46 C22.2 R11.1 38.35,23.71 R9.1
N$19
  Top 0.254: C20.1 R9.2
N$20
  Top 0.254: 34.71,28.7 C21.2 R10.2 R8.1 37.08,25.4 36.45,24.77 IC3.3
N$21
  Top 0.254: C19.2 R8.2
N$22
  Top 0.254: IC3.1 36.36,22.23 C22.1 R11.2 38.18,21.68 C23.1
N$23
  Top 0.254: R14.1 33.27,27.43 30.61,24.77 IC3.6 29.56,24.73 R16.1 C27.2
N$24
  Top 0.254: C25.1 R14.2
N$25
  Top 0.254: C26.2 R15.2 R13.1 32,27.43 30.61,26.04 IC3.5
N$26
  Top 0.254: C24.2 R13.2
N$27
  Top 0.254: C28.1 32.26,19.89 32.26,22.1 30.86,23.5 IC3.7 27.65,23.5 R16.2 C27.1
N$28
  Top 0.254: IC2.3 21.91,15.81 21.84,15.75 21.84,15.49 22.86,14.48 SJ1.1
N$29
  Top 0.305: IC1.11 3.57,9.41 2.79,8.64 2.79,8.26 JP3.1
N$30
  Top 0.305: IC1.3 2.92,14.61 2.79,14.48 1.4,14.48 0.76,13.84 0.76,11.05 JP3.2
N$31
  Top 0.406: IC4.21 14.43,47.96 JP4.1
N$32
  Top 0.406: IC4.20 13.02,48.96 JP4.2
N$33
  Top 0.305: IC4.14 20.39,55.31 | 20.39,55.31 18.29,57.4 14.96,57.4 LED3.A | LED4.C 23.25,58.17 20.39,55.31
N$34
  Top 0.305: R18.1 12.48,57.94 LED3.C
N$35
  Top 0.305: LED4.A 26.91,56.63 26.76,56.48 | R19.2 26.76,56.48 | 26.76,56.48 26.67,56.39
RIGHT
  Top 0.254: R17.1 27.09,19.3 C28.2 31.5,16.43 31.5,11.94 30,10.44 J2.3
RIGHT+
  Top 0.254: IC4.47 33.39,34.69 33.27,34.54 C25.2
RIGHT-
  Top 0.254: IC4.46 32.39,34.51 C24.1
RX
  Top 0.305: IC4.15 19.39,54.78 17.78,56.39 14.99,56.39 13.46,54.86 5.33,54.86 3.05,52.58 3.05,22.35 JP1.2 3.21,20.66 3.21,20.15 R1.2
TX
  Top 0.305: IC4.16 18.39,54.26 17.27,55.37 15.49,55.37 13.97,53.85 5.84,53.85 4.06,52.07 4.06,24.13 5.59,22.61 JP1.1 R2.2
V+  (via drill 0.51)
  Top 0.254: IC3.8 29.08,22.23 | 29.08,22.23 v28.57,21.08 | IC2.1 25.46,16.29 C15.1 25.82,16.26 v26.92,16.26 | C16.1 18.8,13.21 v18.54,12.95 | D2.2 20,27.5 19.56,27.94 19.56,30.23 v20.07,30.73 | C18.2 v28.57,21.08 | v20.07,30.73 20.15,30.9 R6.2 20.83,30.73 v20.07,30.73 | 29.08,22.23 29.08,21.97 v28.57,21.08 | D1.2 27.87,30.41 v28.19,30.73 27.77,30.31 D1.2
  Top 0.406: C16.1 L4.2
  Bottom 0.254: 22.35,16.26 v26.92,16.26 26.92,16.76 28.45,18.29 v28.57,21.08 28.7,21.34 | 28.45,30.73 v28.19,30.73 27.43,31.5 20.83,31.5 v20.07,30.73 20.07,32.26 18.29,32.26 17.53,31.24 17.53,17.78 17.78,17.53 21.08,17.53 22.35,16.26 | v18.54,12.95 18.54,14.48 19.56,15.49 21.59,15.49 22.35,16.26

### Text on the board
tNames: A.T. | BT Audio iJoey | Revision 0.2
Measures: Power LED | Serial LED
Document: NOTES: | 1. All dimensions are in Inches unless otherwise specified | 2. Finished board thickness 0.061 inches +/- 0.006" | 3. PCB Construction: Std. 2-layer stackup, 0.5oz CU | 4. Soldermask over bare copper, both sides | 5. Silkscreen on TOP side only, clip from solder lands | 6. Minimum Conductor Width/Spacing: 8mil | 7. PCB Material: FR-4 or equivalent | 8. Files are in Gerber 274X format | 9. Finished PCB Warpage and Twist per IPC-6012 | 10. Layer to layer registration variation +/- 0.005" | 11. Hole size variation +/- 0.004" of the finished drill size | 12. Board outline variation +/- 0.010" of board outline layer | 13. Remove all burrs if present | 14. Ensure LED3-4 are mounted Right Angle, see datasheet | Revision 0.2 | Bug Labs INC. | www.buglabs.net | ENGR: Andrew Tergis | andrew.tergis@buglabs.net
tAssy: LED3 | LED4 | R18 | R19
DrillLegend: LAYER-STACK
DrillLegend_01-16: 01-16
DrillLegend_01-20: 01-20